# EAGLE design FreeVario F101 V1.1 (EAGLE 8.2.2)
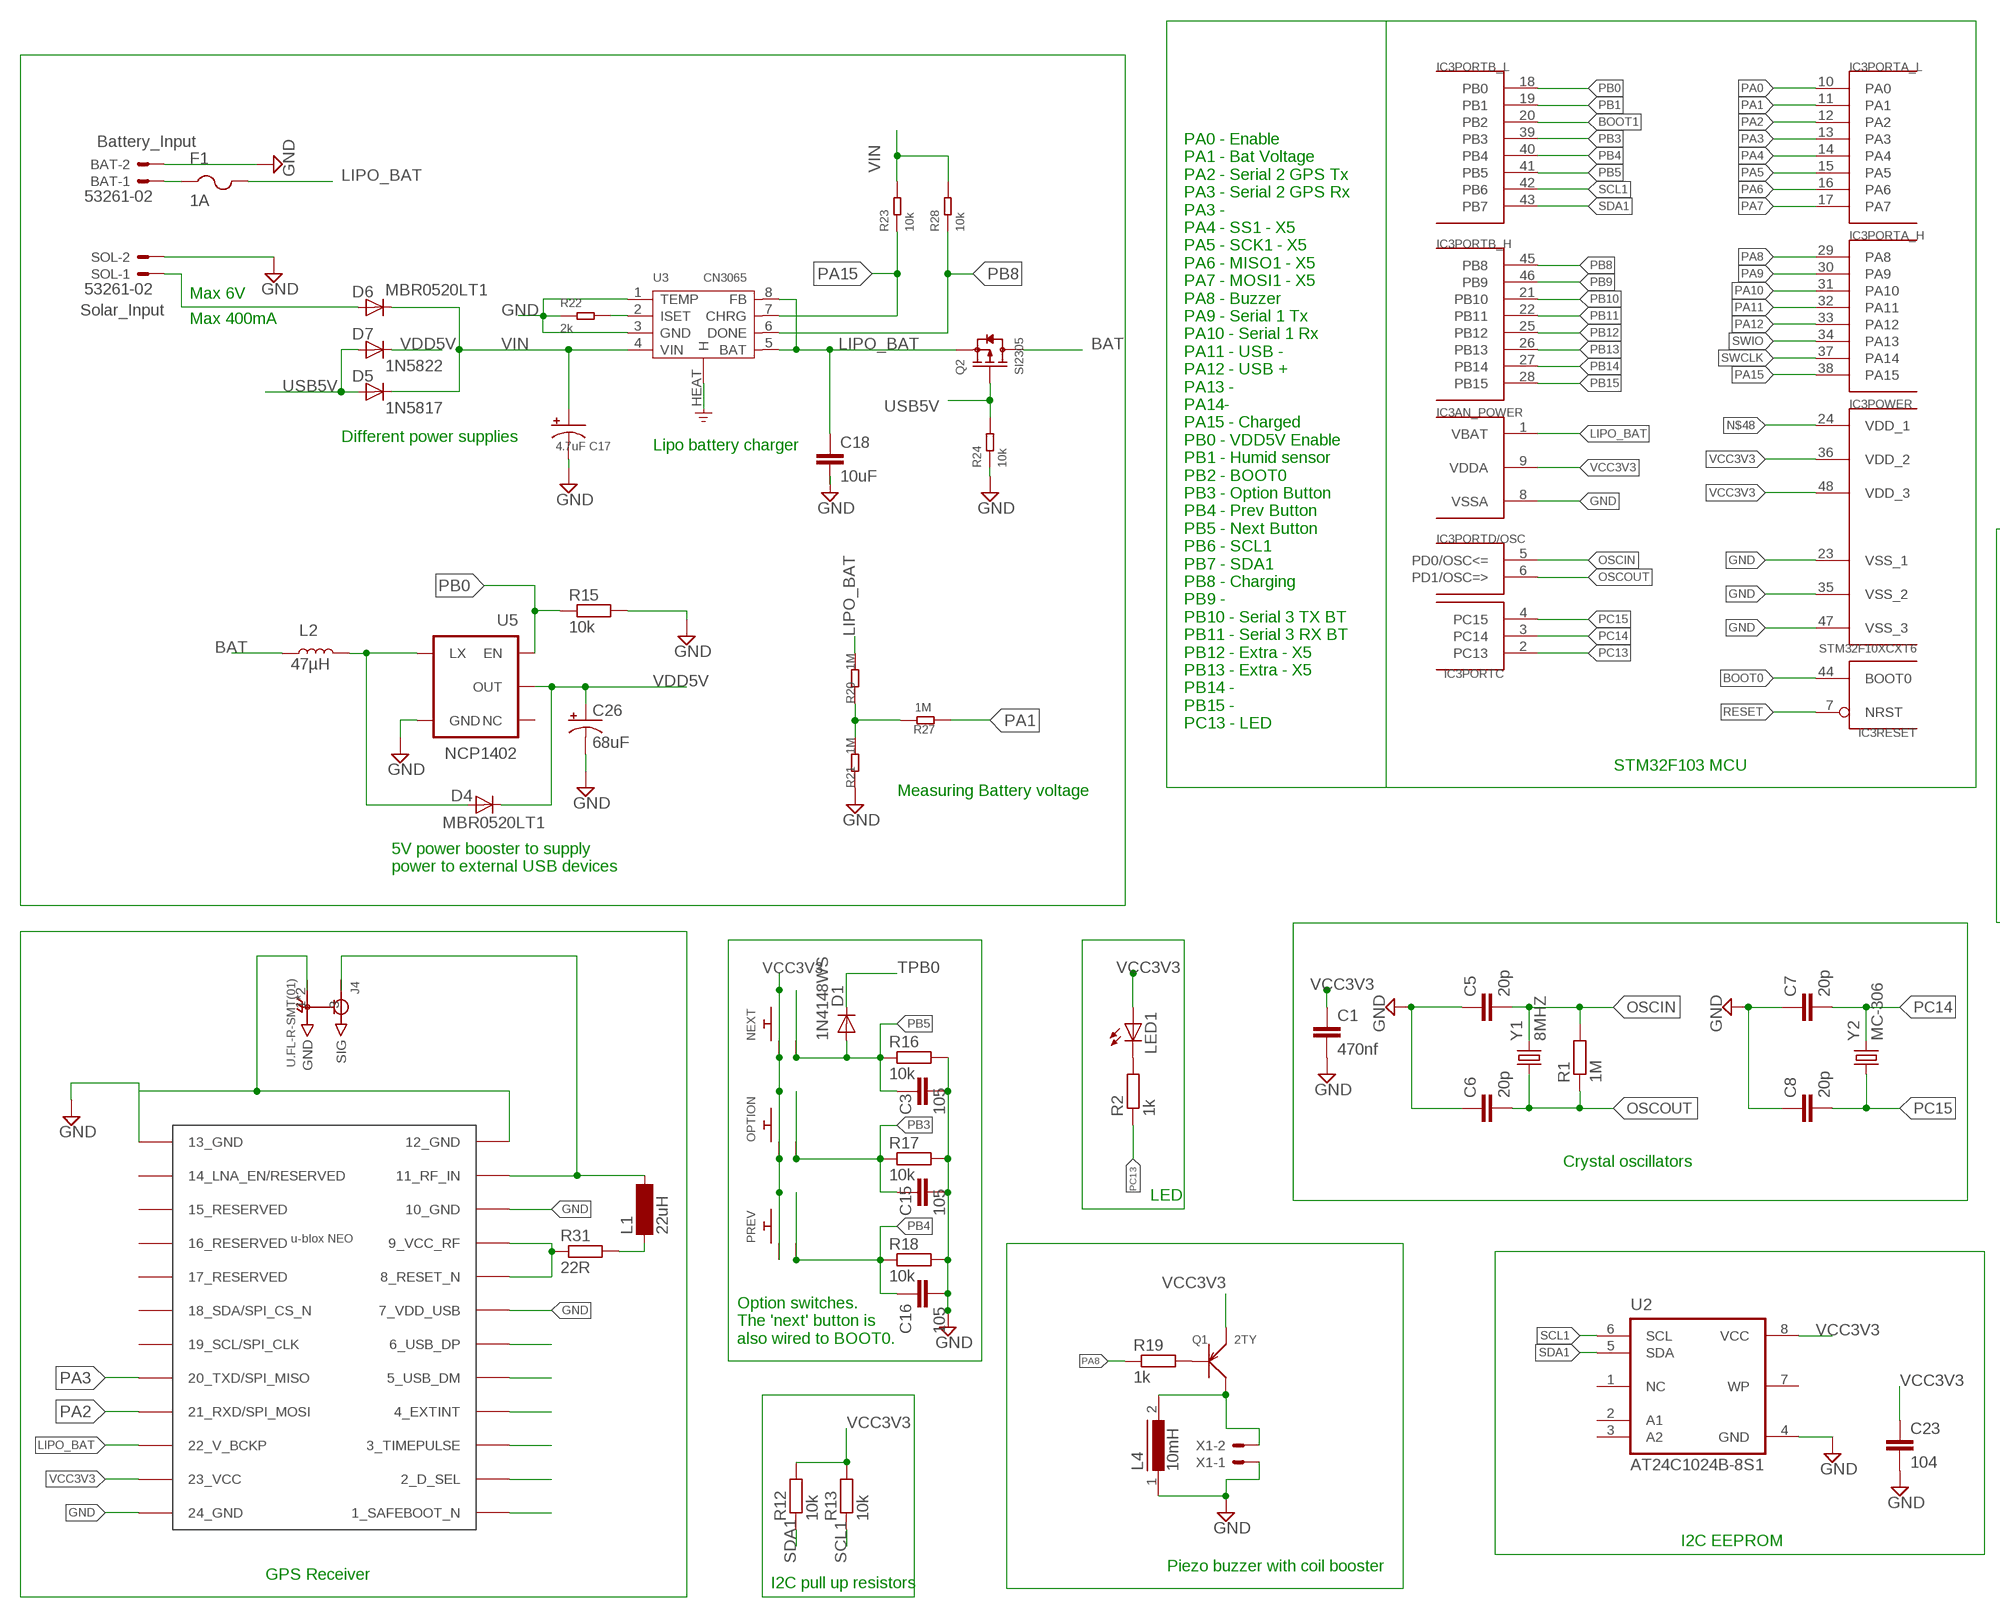
[diagram p0: schematic, sheet 1, part 1 of 2]
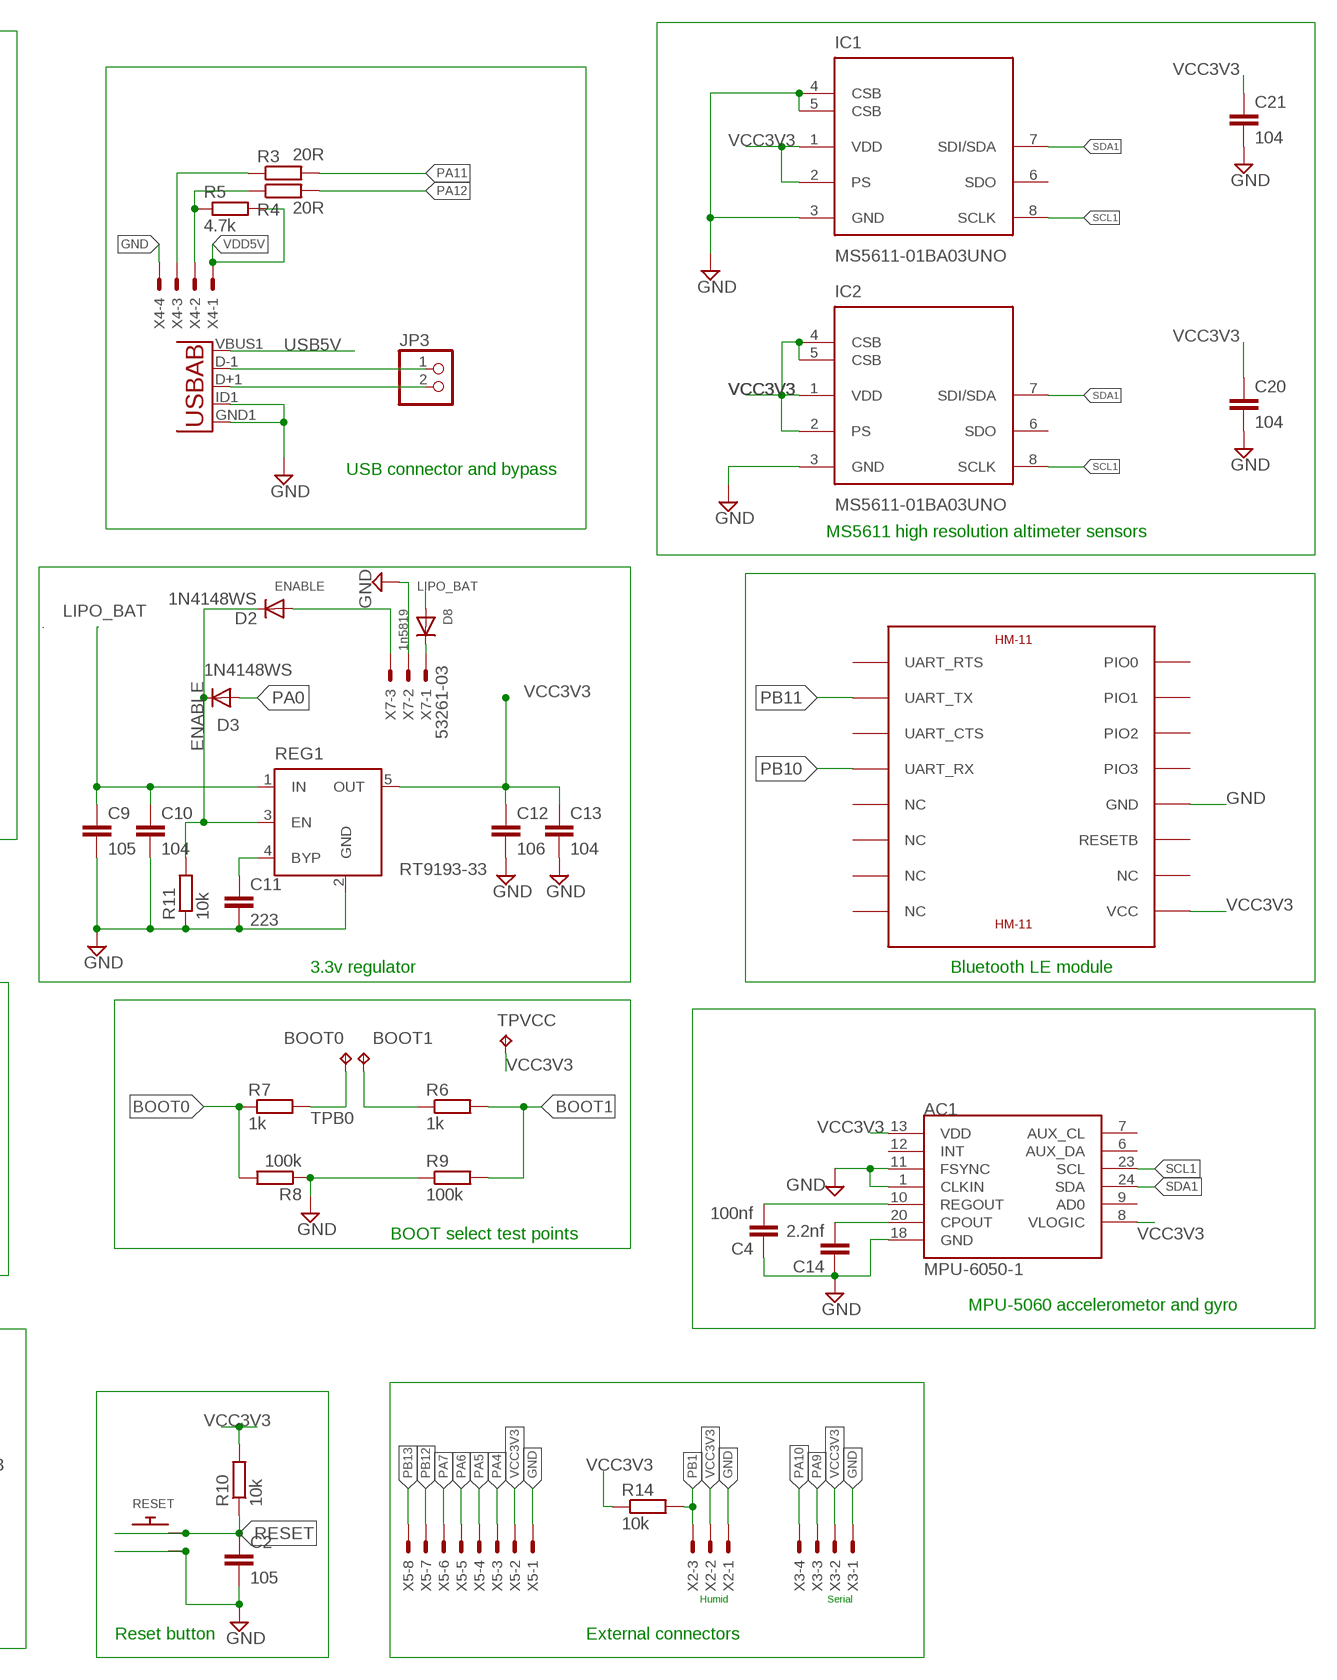
[diagram p1: schematic, sheet 1, part 2 of 2]

## Parts
AC1  MPU-6050-1  [QFN-24-4MM2]
BAT  53261-02  [53261-02]
BOOT0  TPTP08R  [TP08R]
BOOT1  TPTP08R  [TP08R]
C1  470nf  C-EUC0603K  [C0603K]
C2  105  C-EUC0603  [C0603]
C3  105  C-EUC0603  [C0603]
C4  100nf  C-EUC0603K  [C0603K]
C5  20p  C-EUC0603K  [C0603K]
C6  20p  C-EUC0603K  [C0603K]
C7  20p  C-EUC0603K  [C0603K]
C8  20p  C-EUC0603K  [C0603K]
C9  105  C-EUC0603K  [C0603K]
C10  104  C-EUC0603K  [C0603K]
C11  223  C-EUC0603K  [C0603K]
C12  106  C-EUC0603K  [C0603K]
C13  104  C-EUC0603K  [C0603K]
C14  2.2nf  C-EUC0603K  [C0603K]
C15  105  C-EUC0603  [C0603]
C16  105  C-EUC0603  [C0603]
C17  4.7uF  10UF-POLAR-EIA3216-16V-10%(TANT)  [EIA3216]
C18  10uF  C-EUC0805  [C0805]
C20  104  C-EUC0603K  [C0603K]
C21  104  C-EUC0603K  [C0603K]
C23  104  C-EUC0603K  [C0603K]
C26  68uF  CAP_POL3528  [EIA3528]
D1  1N4148WS  DIODE-SOD323-R  [SOD323-R]
D2  1N4148WS  DIODE-SOD323-R  [SOD323-R]
D3  1N4148WS  DIODE-SOD323-R  [SOD323-R]
D4  MBR0520LT1  DIODESOD-123  [SOD-123]
D5  1N5817  DIODESOD-123  [SOD-123]
D6  MBR0520LT1  DIODESOD-123  [SOD-123]
D7  1N5822  DIODE-DO-214AC  [DO-214AC]
D8  1n5819  DIODESOD-123  [SOD-123]
F1  1A  PTCFUSE-1206  [R1206]
HM13  HM-11  [HM-11]
IC1  MS5611-01BA03UNO  [SON125P300X500X100-8N]
IC2  MS5611-01BA03UNO  [SON125P300X500X100-8N]
IC3  STM32F10XCXT6  [TQFP48]
J4  U.FL-R-SMT(01)  [HRS_U.FL-R-SMT(01)]
JP3  PINHD-1X2  [1X02]
L1  22uH  SM-1206  [SM-1206]
L2  47µH  INDUCTOR-CR54-47UH  [CR54]
L4  10mH  MMICC7  [MMICC7]
LED1  LEDCHIP-LED0603  [CHIP-LED0603]
NEXT  TS-015A  [TS-015A]
OPTION  TS-015A  [TS-015A]
PREV  TS-015A  [TS-015A]
Q1  2TY  SMD-TRANSISTORS-PNP-25V-500MA(SOT-23)  [SOT-23]
Q2  SI2305  MOSFET-P'SI2323CDS/SI2305DS<BR>'  [SOT-23]
R1  1M  R-EU_R0603  [R0603]
R2  1k  R-EU_R0603  [R0603]
R3  20R  R-EU_R0603  [R0603]
R4  20R  R-EU_R0603  [R0603]
R5  4.7k  R-EU_R0603  [R0603]
R6  1k  R-EU_R0603  [R0603]
R7  1k  R-EU_R0603  [R0603]
R8  100k  R-EU_R0603  [R0603]
R9  100k  R-EU_R0603  [R0603]
R10  10k  R-EU_R0603  [R0603]
R11  10k  R-EU_R0603  [R0603]
R12  10k  R-EU_R0603  [R0603]
R13  10k  R-EU_R0603  [R0603]
R14  10k  R-EU_R0603  [R0603]
R15  10k  R-EU_R0603  [R0603]
R16  10k  R-EU_R0603  [R0603]
R17  10k  R-EU_R0603  [R0603]
R18  10k  R-EU_R0603  [R0603]
R19  1k  R-EU_R0603  [R0603]
R20  1M  R-0603  [0603]
R21  1M  R-0603  [0603]
R22  2k  RES-0603  [R0603]
R23  10k  RES-0603  [R0603]
R24  10k  RES-0603  [R0603]
R27  1M  R-0603  [0603]
R28  10k  RES-0603  [R0603]
R31  22R  R-EU_R0603  [R0603]
REG1  RT9193-33  MIC5219XX  [SOT23-5]
RESET  TS-015A  [TS-015A]
SOL  53261-02  [53261-02]
TPVCC  TPTP08SQ  [TP08SQ]
U1  USB""  [USB-MICRO-SMD]
U2  AT24C1024B-8S1  [SO08-8S1]
U3  CN3065  PMIC-CN3065-DFN8  [DFN-8]
U4  NEO-M8  [NEO-M8]
U5  NCP1402  V_REG_NCP1400SOT23-5  [SOT23-5]
X1  53261-02  [53261-02]
X2  53261-03  [53261-03]
X3  53261-04  [53261-04]
X4  53261-04  [53261-04]
X5  53261-08  [53261-08]
X7  53261-03  [53261-03]
Y1  8MHZ  CRYSTALSM49  [SM49]
Y2  MC-306  [MC-306]

## Nets
BAT: L2.P$1 Q2.3(D)
BOOT0: IC3.44(RESET:BOOT0) R7.1 R8.2
BOOT1: IC3.20(PORTB_L:PB2) R6.2 R9.2
ENABLE: D2.C D3.C R11.2 REG1.3(EN)
GND: AC1.1(CLKIN) AC1.11(FSYNC) AC1.18(GND) BAT.2 C1.2 C2.2 C3.2 C4.1 C5.1 C6.1 C7.1 C8.1 C9.2 C10.2 C11.2 C12.2 C13.2 C14.1 C15.2 C16.2 C17.- C18.2 C20.2 C23.2 C26.C(-) HM13.GND IC1.3(GND) IC1.4(CSB) IC1.5(CSB) IC2.3(GND) IC3.8(AN_POWER:VSSA) IC3.23(POWER:VSS_1) IC3.35(POWER:VSS_2) IC3.47(POWER:VSS_3) J4.1(GND) J4.2(GND) L4.1 R8.1 R9.1 R11.1 R15.2 R16.2 R17.2 R18.2 R21.1 R22.1 R24.1 REG1.2(GND) RESET.P$2 RESET.P$4 SOL.2 U1.GND1(GND) U1.ID1(USBID) U2.4(GND) U3.1(TEMP) U3.3(GND) U3.HEAT(H) U4.7(7_VDD_USB) U4.10(10_GND) U4.12(12_GND) U4.13(13_GND) U4.24(24_GND) U5.4(GND) X1.1 X2.1 X3.1 X4.4 X5.1 X7.2 ; supply symbol labelled GND_POWER
LIPO_BAT: C9.1 C10.1 C18.1 D8.A F1.2 IC3.1(AN_POWER:VBAT) Q2.2(S) R20.2 REG1.1(IN) U3.5(BAT) U3.8(FB) U4.22(22_V_BCKP)
N$1: D8.C X7.1
N$4: LED1.C R2.2
N$5: C11.1 REG1.4(BYP)
N$8: R3.1 X4.3
N$9: R4.1 R5.1 X4.2
N$11: BAT.1 F1.1
N$12: BOOT1.TP R6.1
N$17: R20.1 R21.2 R27.2
N$25: D2.A X7.3
N$28: Q1.1(B) R19.2
N$29: D6.A SOL.1
N$30: AC1.10(REGOUT) C4.2
N$32: R22.2 U3.2(ISET)
N$33: AC1.20(CPOUT) C14.2
N$34: L4.2 Q1.3(C) X1.2
N$36: JP3.1 U1.D-1(D-)
N$38: JP3.2 U1.D+1(D+)
N$40: D4.A L2.P$2 U5.5(LX)
N$42: J4.3(SIG) L1.2 U4.11(11_RF_IN)
N$43: L1.1 R31.2
N$45: R31.1 U4.8(8_RESET_N) U4.9(9_VCC_RF)
N$48: IC3.24(POWER:VDD_1)
N$52: U4.6(6_USB_DP)
N$54: U4.5(5_USB_DM)
N$55: U4.4(4_EXTINT)
N$56: U4.3(3_TIMEPULSE)
N$57: U4.2(2_D_SEL)
N$58: U4.1(1_SAFEBOOT_N)
OSCIN: C5.2 IC3.5(PORTD/OSC:PD0/OSC<=) R1.2 Y1.2
OSCOUT: C6.2 IC3.6(PORTD/OSC:PD1/OSC=>) R1.1 Y1.1
PA0: D3.A IC3.10(PORTA_L:PA0)
PA1: IC3.11(PORTA_L:PA1) R27.1
PA2: IC3.12(PORTA_L:PA2) U4.21(21_RXD/SPI_MOSI)
PA3: IC3.13(PORTA_L:PA3) U4.20(20_TXD/SPI_MISO)
PA4: IC3.14(PORTA_L:PA4) X5.3
PA5: IC3.15(PORTA_L:PA5) X5.4
PA6: IC3.16(PORTA_L:PA6) X5.5
PA7: IC3.17(PORTA_L:PA7) X5.6
PA8: IC3.29(PORTA_H:PA8) R19.1
PA9: IC3.30(PORTA_H:PA9) X3.3
PA10: IC3.31(PORTA_H:PA10) X3.4
PA11: IC3.32(PORTA_H:PA11) R3.2
PA12: IC3.33(PORTA_H:PA12) R4.2
PA15: IC3.38(PORTA_H:PA15) R23.1 U3.7(CHRG)
PB0: IC3.18(PORTB_L:PB0) R15.1 U5.1(EN)
PB1: IC3.19(PORTB_L:PB1) R14.2 X2.3
PB3: C15.1 IC3.39(PORTB_L:PB3) OPTION.P$2 OPTION.P$4 R17.1
PB4: C16.1 IC3.40(PORTB_L:PB4) PREV.P$2 PREV.P$4 R18.1
PB5: C3.1 D1.A IC3.41(PORTB_L:PB5) NEXT.P$2 NEXT.P$4 R16.1
PB8: IC3.45(PORTB_H:PB8) R28.1 U3.6(DONE)
PB9: IC3.46(PORTB_H:PB9)
PB10: HM13.UART_RX IC3.21(PORTB_H:PB10)
PB11: HM13.UART_TX IC3.22(PORTB_H:PB11)
PB12: IC3.25(PORTB_H:PB12) X5.7
PB13: IC3.26(PORTB_H:PB13) X5.8
PB14: IC3.27(PORTB_H:PB14)
PB15: IC3.28(PORTB_H:PB15)
PC13: IC3.2(PORTC:PC13) R2.1
PC14: C7.2 IC3.3(PORTC:PC14) Y2.4
PC15: C8.2 IC3.4(PORTC:PC15) Y2.1
RESET: C2.1 IC3.7(RESET:NRST) R10.1 RESET.P$1 RESET.P$3
SCL1: AC1.23(SCL) IC1.8(SCLK) IC2.8(SCLK) IC3.42(PORTB_L:PB6) R13.1 U2.6(SCL)
SDA1: AC1.24(SDA) IC1.7(SDI/SDA) IC2.7(SDI/SDA) IC3.43(PORTB_L:PB7) R12.1 U2.5(SDA)
SWCLK: IC3.37(PORTA_H:PA14)
SWIO: IC3.34(PORTA_H:PA13)
TPB0: BOOT0.TP D1.C R7.2
USB5V: D5.A D7.A Q2.1(G) R24.2 U1.VBUS1(VBUS)
VCC3V3: AC1.8(VLOGIC) AC1.13(VDD) C1.1 C12.1 C13.1 C20.1 C21.1 C23.1 HM13.VCC IC1.1(VDD) IC1.2(PS) IC2.1(VDD) IC2.2(PS) IC2.4(CSB) IC2.5(CSB) IC3.9(AN_POWER:VDDA) IC3.36(POWER:VDD_2) IC3.48(POWER:VDD_3) LED1.A NEXT.P$1 NEXT.P$3 OPTION.P$1 OPTION.P$3 PREV.P$1 PREV.P$3 Q1.2(E) R10.2 R12.2 R13.2 R14.1 REG1.5(OUT) TPVCC.TP U2.8(VCC) U4.23(23_VCC) X2.2 X3.2 X5.2
VDD5V: C26.A(+) D4.C D7.C R5.2 U5.2(OUT) X4.1
VIN: C17.+ D5.C D6.C R23.2 R28.2 U3.4(VIN)
Unconnected: AC1.6(AUX_DA) AC1.7(AUX_CL) AC1.9(AD0) AC1.12(INT) C21.2 HM13.NC@5(NC) HM13.NC@6(NC) HM13.NC@7(NC) HM13.NC@8(NC) HM13.NC@10(NC) HM13.PIO0 HM13.PIO1 HM13.PIO2 HM13.PIO3 HM13.RESETB HM13.UART_CTS HM13.UART_RTS IC1.6(SDO) IC2.6(SDO) U2.1(NC) U2.2(A1) U2.3(A2) U2.7(WP) U4.14(14_LNA_EN/RESERVED) U4.15(15_RESERVED) U4.16(16_RESERVED) U4.17(17_RESERVED) U4.18(18_SDA/SPI_CS_N) U4.19(19_SCL/SPI_CLK) U5.3(NC)

## Notes on the sheet
- Battery_Input
- Max 6V
- Solar_Input
- Max 400mA
- Different power supplies | USB connector and bypass
- Lipo battery charger
- MS5611 high resolution altimeter sensors
- PA0 - Enable
  PA1 - Bat Voltage
  PA2 - Serial 2 GPS Tx
  PA3 - Serial 2 GPS Rx
  PA3 - 
  PA4 - SS1 - X5
  PA5 - SCK1 - X5
  PA6 - MISO1 - X5
  PA7 - MOSI1 - X5
  PA8 - Buzzer
  PA9 - Serial 1 Tx
  PA10 - Serial 1 Rx
  PA11 - USB -
  PA12 - USB +
  PA13 - 
  PA14- 
  PA15 - Charged
  PB0 - VDD5V Enable
  PB1 - Humid sensor
  PB2 - BOOT0
  PB3 - Option Button
  PB4 - Prev Button
  PB5 - Next Button
  PB6 - SCL1
  PB7 - SDA1
  PB8 - Charging
  PB9 -  
  PB10 - Serial 3 TX BT
  PB11 - Serial 3 RX BT
  PB12 - Extra - X5
  PB13 - Extra - X5
  PB14 - 
  PB15 - 
  PC13 - LED
- STM32F103 MCU
- Measuring Battery voltage
- 5V power booster to supply 
  power to external USB devices
- 3.3v regulator | Bluetooth LE module
- Crystal oscillators | BOOT select test points
- LED
- MPU-5060 accelerometor and gyro
- Option switches. 
  The 'next' button is 
  also wired to BOOT0.
- Humid | Serial
- I2C EEPROM | Reset button | External connectors
- Piezo buzzer with coil booster
- GPS Receiver
- I2C pull up resistors

## Library data of the parts
AC1 = mpu5060:MPU-6050
BAT SOL = con-molex:53?-02: CONNECTOR wire to board 1.25 mm (.049 inch) pitch header; OC_FARNELL: 1125373; OC_NEWARK: unknown
BOOT0 BOOT1 TPVCC = testpad:TP: Test pad
C1-C16 C18 C20 C21 C23 = rcl:C-EU: CAPACITOR, European symbol
C17 = SparkFun-Capacitors:10UF-POLAR: 10.0µF polarized capacitors A capacitor is a passive two-terminal electrical component used to store electrical energy temporarily in an electric field.; PROD_ID: CAP-00811; VALUE: 10uF
C26 = SparkFun:CAP_POL: Capacitor Polarized These are standard SMD and PTH capacitors. Normally 10uF, 47uF, and 100uF in electrolytic and tantalum varieties. Always verify the external diameter of the through hole cap, it varies with capacity, voltage, and manufacturer. The EIA devices should be standard.
D1-D3 D7 = diode:DIODE-: DIODE
D4-D6 D8 = adafruit:DIODE: Diode SMADIODE - SMA Surface Mount Package 20V 1A Schottky Diode Digikey: 641-1014-6-ND DO-1N4148 - Through Hole Small Current Diode SOD-123 20V 1 A (.5mV Vf) Schottky Diode - Digikey: MBRX120TPMSCT-ND SOD-323 10V 570mA (.38mV Vf, 3ns) Schottky Diode - Digikey: ZLLS410CT-ND SOD-523 30V 30mA Schottky Diode (RB751S-40TE61) - Digikey: RB751S-40TE61CT-ND SOT23-R/W - SOT23 Package (R = Solder Paste/Reflow Ovens, W = Hand-Soldering) BAT54Film 40V 300mA - Digikey: 497-7162-1-ND
F1 = adafruit:PTCFUSE: PTC fuses, resettable thermistors
HM13 = hm-11:HM-11: JNHuaMao HM-11 Bluetooth 4.0 Transceiver based on TI CC2540/CC2541
IC1 IC2 = Measurement-Specialties:MS5611-01BA03: Variometer Module, with stainless steel cap
IC3 = stm32:STM32F10XCXT6: ST STM32F101/103 48pin LQFP
J4 = U.FL-R-SMT_01_:U.FL-R-SMT(01): U.FL Series 6 Ghz 50 Ohm Ultra-small SMT Coaxial Cable Receptacle; AVAILABILITY: Good; DESCRIPTION: U.FL Series 6 Ghz 50 Ohm Ultra-small SMT Coaxial Cable Receptacle; MF: Hirose; MP: U.FL-R-SMT(01); PACKAGE: None; PRICE: 0.85 USD
JP3 = pinhead:PINHD-1X2: PIN HEADER
L1 = inductor-neosid:SM-1206: INDUCTOR SMD chip inductor; OC_FARNELL: unknown; OC_NEWARK: unknown
L2 = SparkFun-Coils:INDUCTOR: Inductors Resist changes in electrical current. Basically a coil of wire. SparkFun Products: SparkFun Load Cell Amplifier - HX711 <https://www.sparkfun.com/products/13879> IOIO-OTG - V2.2 <https://www.sparkfun.com/products/13613>; PROD_ID: NDUC-10789; VALUE: 47µH/±30%/750mA
L4 = inductors:MMICC7: INDUCTOR
LED1 = adafruit:LED: LED OSRAM: - CHIPLED LG R971, LG N971, LY N971, LG Q971, LY Q971, LO R971, LY R971 LH N974, LH R974 LS Q976, LO Q976, LY Q976 LO Q996 - Hyper CHIPLED LW Q18S LB Q993, LB Q99A, LB R99A - SideLED LS A670, LO A670, LY A670, LG A670, LP A670 LB A673, LV A673, LT A673, LW A673 LH A674 LY A675 LS A676, LA A676, LO A676, LY A676, LW A676 LS A679, LY A679, LG A679 - Hyper Micro SIDELED® LS Y876, LA Y876, LO Y876, LY Y876 LT Y87S - SmartLED LW L88C, LW L88S LB L89C, LB L89S, LG L890 LS L89K, LO L89K, LY L89K LS L896, LA L896, LO L896, LY L896 - TOPLED LS T670, LO T670, LY T670, LG T670, LP T670 LSG T670, LSP T670, LSY T670, LOP T670, LYG T670 LG T671, LOG T671, LSG T671 LB T673, LV T673, LT T673, LW T673 LH T674 LS T676, LA T676, LO T676, LY T676, LB T676, LH T676, LSB T676, LW T676 LB T67C, LV T67C, LT T67C, LS T67K, LO T67K, LY T67K, LW E67C LS E67B, LA E67B, LO E67B, LY E67B, LB E67C, LV E67C, LT E67C LW T67C LS T679, LY T679, LG T679 LS T770, LO T770, LY T770, LG T770, LP T770 LB T773, LV T773, LT T773, LW T773 LH T774 LS E675, LA E675, LY E675, LS T675 LS T776, LA T776, LO T776, LY T776, LB T776 LHGB T686 LT T68C, LB T68C - Hyper Mini TOPLED® LB M676 - Mini TOPLED Santana® LG M470 LS M47K, LO M47K, LY M47K Source: http://www.osram.convergy.de/
NEXT OPTION PREV RESET = ts-015a switch:TS-015A: TS-15A
Q1 = SMD-TRANSISTORS-PNP-25V-500MA_SOT-23_:SMD-TRANSISTORS-PNP-25V-500MA(SOT-23): 305020006; AVAILABILITY: Unavailable; DESCRIPTION: SMD Transistors PNP 25V 500mA; MF: Seeed Studio; MP: S8550; PACKAGE: None; PRICE: None
Q2 = Discrete-new:MOSFET-P
R1-R18 R31 = rcl:R-EU_: RESISTOR, European symbol
R19 = resistor:R-EU_: RESISTOR, European symbol
R20 R21 R27 = Discrete:R*
R22-R24 R28 = Discrete-new:RES
REG1 = v-reg-micrel:MIC5219XX: VOLTAGE REGULATOR; OC_FARNELL: unknown; OC_NEWARK: unknown
U1 = MicroUSB:USB: This is a USB AB connector that is compatible with USB OTG. i.e. this connector can serve as a host or device
U2 = memory-atmel:AT24C1024B: EEPROM SPI bus serial, 1M (131,072 x 8)
U3 = IC-new:PMIC-CN3065: 310030101
U4 = ubloxLib:NEO-M8: u-blox NEO GNSS module
U5 = SparkFun:V_REG_NCP1400: Switching step-up voltage regulator NCP1400 switiching regulator takes single cell AA and outputs 100mA at 3.3V or 5V with minimal number of external components.
X1 = con-molex:53?-02: CONNECTOR wire to board 1.25 mm (.049 inch) pitch header
X2 = con-molex:53?-03: CONNECTOR wire to board 1.25 mm (.049 inch) pitch header
X3 X4 = con-molex:53?-04: CONNECTOR wire to board 1.25 mm (.049 inch) pitch header
X5 = con-molex:53?-08: CONNECTOR wire to board 1.25 mm (.049 inch) pitch header
X7 = con-molex:53?-03: CONNECTOR wire to board 1.25 mm (.049 inch) pitch header; MF: MOLEX; MPN: 53261-0390; OC_FARNELL: 1125359; OC_NEWARK: 57H5006
Y1 = adafruit:CRYSTAL: CRYSTAL; OC_FARNELL: unknown; OC_NEWARK: unknown
Y2 = crystal:MC-306: kHz RANGE CRYSTAL UNIT SMD Source: MC-306_405_406_E07X.PDF Homepage <http://www.epsontoyocom.co.jp>; MPN: MC-306 60.0KHZ 100PPM ,12.5PF; OC_FARNELL: 1278040; OC_NEWARK: 31M5576

## Board
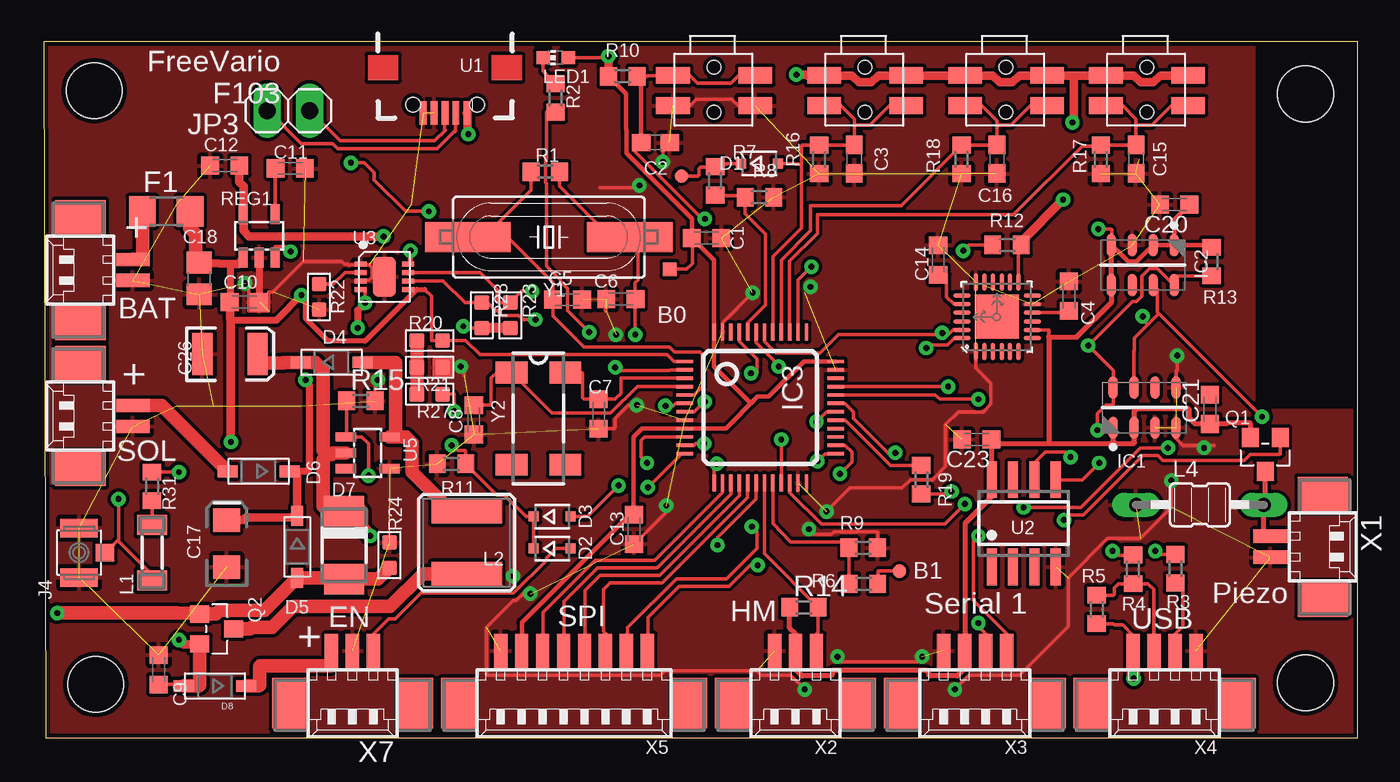
[diagram p2: board, top side]
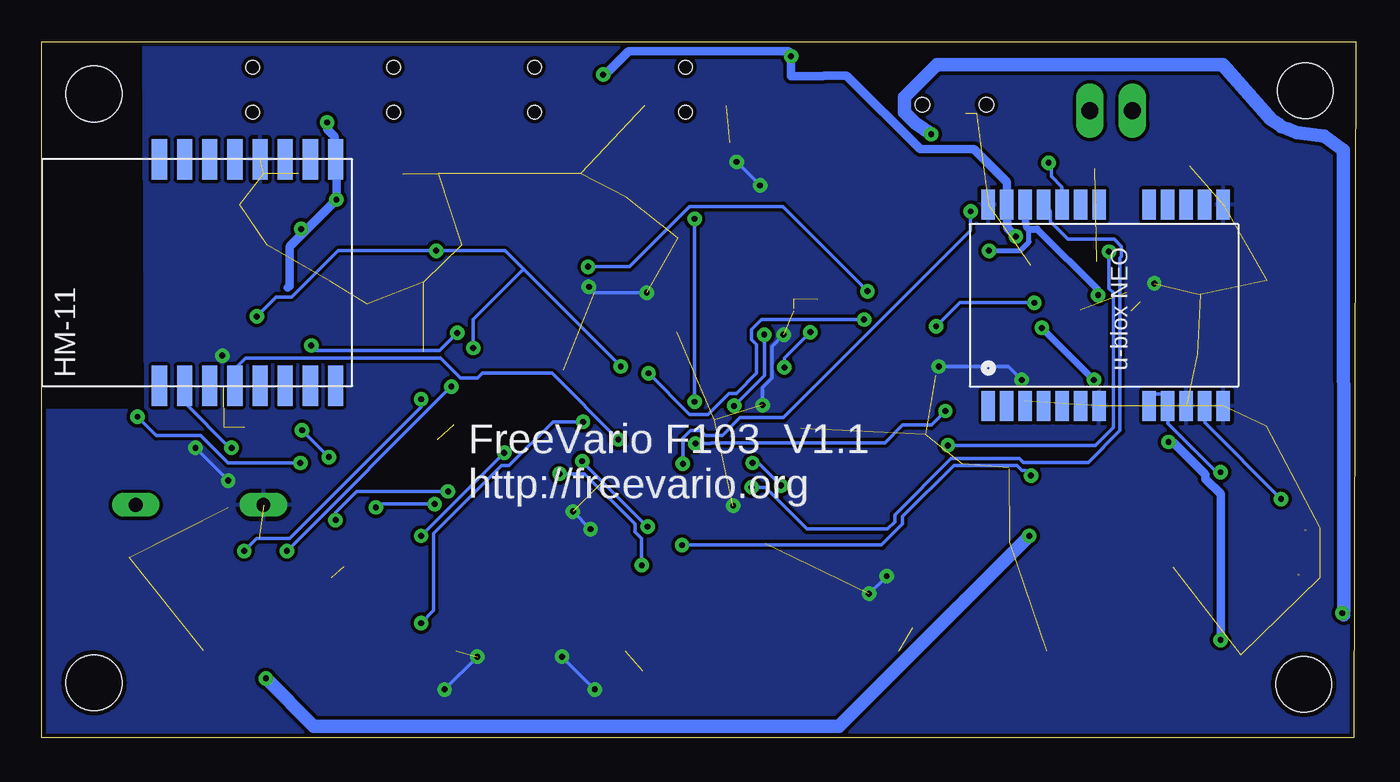
[diagram p3: board, bottom side, seen from below]

Size 78.3 x 41.5 mm. Coordinates in mm from the lower left corner, seen from the top.
Outline: 78.3,0 78.3,41.5 0,41.5 0.1,0 78.3,0
Copper layers (1*16): Top 0.035mm / dielectric 1.5mm / Bottom 0.035mm
Design rules "SparkFun": minimum track width 8mil, minimum drill 20mil, track to track 8mil, track to pad 8mil, pad to pad 8mil, via to via 8mil, smd to smd 8mil, copper to edge 10mil, drill to drill 8mil, minimum pad ring 12mil, minimum via ring 10mil, stop-mask expansion 4mil, vias tented up to drill 25mil, thermal gap 10mil
tRestrict: area 72.3,19.7 to 78.3,41.5
bRestrict: area 72.3,19.7 to 78.3,41.5

### Footprints (pad centres in the part's own frame; a part is rotated, then mirrored left to right if it is on the bottom)
QFN-24-4MM2 = smd 1.016 x 0.254: 1 -2.066,1.257; 2 -2.066,0.75; 3 -2.066,0.247; 4 -2.066,-0.287; 5 -2.066,-0.792; 6 -2.066,-1.297; 13 2.086,-1.297; 14 2.086,-0.792; 15 2.086,-0.287; 16 2.086,0.247; 17 2.086,0.75; 18 2.086,1.257 | smd 0.254 x 1.016: 7 -1.267,-2.122; 8 -0.762,-2.122; 9 -0.258,-2.122; 10 0.278,-2.122; 11 0.78,-2.122; 12 1.287,-2.122; 19 1.287,2.082; 20 0.78,2.082; 21 0.278,2.082; 22 -0.258,2.082; 23 -0.762,2.082; 24 -1.267,2.082 | smd 2.616 x 2.616: P$1 0.02,-0.01
53261-02 = smd 0.8 x 2: 1 0.625,-2.5; 2 -0.625,-2.5 | smd 2.1 x 3: S1 3.125,0.625; S2 -3.125,0.625
TP08R = smd 0.8 x 0.8: TP 0,0
C0603K = smd 1.05 x 1.08: 1 -0.875,0; 2 0.875,0
C0603 = smd 1.1 x 1: 1 -0.85,0; 2 0.85,0
EIA3216 = smd 1.4 x 1.6: + 1.4,0; - -1.4,0
C0805 = smd 1.3 x 1.5: 1 -0.95,0; 2 0.95,0
EIA3528 = smd 1.2 x 2.5: A 1.65,0; C -1.65,0
SOD323-R = smd 0.6 x 0.6: A 1.1,0; C -1.1,0
SOD-123 = smd 1.2 x 0.7: A 1.85,0; C -1.85,0
DO-214AC = smd 1.8 x 2.4: A 2.025,0; C -2.025,0
R1206 = smd 1.6 x 1.803: 1 -1.422,0; 2 1.422,0
HM-11 = smd 2.4 x 0.9: GND 6.5,0; NC@5 -7,0; NC@6 -7,-1.5; NC@7 -7,-3; NC@8 -7,-4.5; NC@10 6.5,-3; PIO0 6.5,6; PIO1 6.5,4.5; PIO2 6.5,3; PIO3 6.5,1.5; RESETB 6.5,-1.5; UART_CTS -7,3; UART_RTS -7,6; UART_RX -7,1.5; UART_TX -7,4.5; VCC 6.5,-4.5
SON125P300X500X100-8N = smd 1.35 x 0.55: 1 -1.2,1.875; 2 -1.2,0.625; 3 -1.2,-0.625; 4 -1.2,-1.875; 5 1.2,-1.875; 6 1.2,-0.625; 7 1.2,0.625; 8 1.2,1.875
TQFP48 = smd 0.2 x 1: 1 -2.75,-4.5; 2 -2.25,-4.5; 3 -1.75,-4.5; 4 -1.25,-4.5; 5 -0.75,-4.5; 6 -0.25,-4.5; 7 0.25,-4.5; 8 0.75,-4.5; 9 1.25,-4.5; 10 1.75,-4.5; 11 2.25,-4.5; 12 2.75,-4.5; 25 2.75,4.5; 26 2.25,4.5; 27 1.75,4.5; 28 1.25,4.5; 29 0.75,4.5; 30 0.25,4.5; 31 -0.25,4.5; 32 -0.75,4.5; 33 -1.25,4.5; 34 -1.75,4.5; 35 -2.25,4.5; 36 -2.75,4.5 | smd 1 x 0.2: 13 4.5,-2.75; 14 4.5,-2.25; 15 4.5,-1.75; 16 4.5,-1.25; 17 4.5,-0.75; 18 4.5,-0.25; 19 4.5,0.25; 20 4.5,0.75; 21 4.5,1.25; 22 4.5,1.75; 23 4.5,2.25; 24 4.5,2.75; 37 -4.5,2.75; 38 -4.5,2.25; 39 -4.5,1.75; 40 -4.5,1.25; 41 -4.5,0.75; 42 -4.5,0.25; 43 -4.5,-0.25; 44 -4.5,-0.75; 45 -4.5,-1.25; 46 -4.5,-1.75; 47 -4.5,-2.25; 48 -4.5,-2.75
HRS_U.FL-R-SMT(01) = smd 1.1 x 2.25: 1 -1.475,0; 2 1.475,0 | smd 1.05 x 1.1: 3 0,-1.55
1X02 = drill 1.016 long: 1 -1.27,0; 2 1.27,0
SM-1206 = smd 1.2 x 1.8: 1 -1.65,0; 2 1.65,0
CR54 = smd 4.2 x 1.4: P$1 0,1.85; P$2 0,-1.85
MMICC7 = drill 0.813 long: 1 -3.81,0; 2 3.81,0
CHIP-LED0603 = smd 0.8 x 0.8: A 0,-0.75; C 0,0.75
TS-015A = smd 2 x 1: P$1 1,0.5; P$2 1,2.3; P$3 5.9,0.5; P$4 5.9,2.3 | hole 0.8: 3.45,2.68; 3.45,0
SOT-23 = smd 1.016 x 1.143: 1 -0.889,-1.016; 2 0.889,-1.016; 3 0,1.016
R0603 = smd 1 x 1.1: 1 -0.85,0; 2 0.85,0
0603 = smd 0.889 x 0.889: 1 -0.762,0; 2 0.762,0
R0603' = smd 0.889 x 0.889: 1 -0.762,0; 2 0.762,0
SOT23-5 = smd 0.55 x 1.2: 1 -0.95,-1.3; 2 0,-1.3; 3 0.95,-1.3; 4 0.95,1.3; 5 -0.95,1.3
TP08SQ = smd 0.8 x 0.8: TP 0,0
USB-MICRO-SMD = smd 1.4 x 0.4: D+1 2.7,0; D-1 2.7,0.65; GND1 2.7,-1.3; ID1 2.7,-0.65; VBUS1 2.7,1.3 | hole 0.85: 2.2,1.9; 2.2,-1.9
SO08-8S1 = smd 0.6 x 2.2: 1 -1.905,-2.6; 2 -0.635,-2.6; 3 0.635,-2.6; 4 1.905,-2.6; 5 1.905,2.6; 6 0.635,2.6; 7 -0.635,2.6; 8 -1.905,2.6
DFN-8 = smd 0.3 x 0.727: 1 -0.75,-1.413; 2 -0.25,-1.413; 3 0.25,-1.413; 4 0.75,-1.413; 5 0.75,1.413; 6 0.25,1.413; 7 -0.25,1.413; 8 -0.75,1.413 | smd 2.413 x 1.397: HEAT 0,0
NEO-M8 = smd 1.8 x 0.8: 1 6.4,-7.4; 2 6.4,-6.3; 3 6.4,-5.2; 4 6.4,-4.1; 5 6.4,-3; 6 6.4,-1.9; 7 6.4,-0.8; 8 6.4,2.2; 9 6.4,3.3; 10 6.4,4.4; 11 6.4,5.5; 12 6.4,6.6; 13 -5.6,6.6; 14 -5.6,5.5; 15 -5.6,4.4; 16 -5.6,3.3; 17 -5.6,2.2; 18 -5.6,-0.8; 19 -5.6,-1.9; 20 -5.6,-3; 21 -5.6,-4.1; 22 -5.6,-5.2; 23 -5.6,-6.3; 24 -5.6,-7.4
STAND-OFF = hole 3.302: 0,0
53261-03 = smd 0.8 x 2: 1 1.25,-2.5; 2 0,-2.5; 3 -1.25,-2.5 | smd 2.1 x 3: S1 3.75,0.625; S2 -3.75,0.625
53261-04 = smd 0.8 x 2: 1 1.875,-2.5; 2 0.625,-2.5; 3 -0.625,-2.5; 4 -1.875,-2.5 | smd 2.1 x 3: S1 4.375,0.625; S2 -4.375,0.625
53261-08 = smd 0.8 x 2: 1 4.375,-2.5; 2 3.125,-2.5; 3 1.875,-2.5; 4 0.625,-2.5; 5 -0.625,-2.5; 6 -1.875,-2.5; 7 -3.125,-2.5; 8 -4.375,-2.5 | smd 2.1 x 3: S1 6.875,0.625; S2 -6.875,0.625
SM49 = smd 5.08 x 1.778: 1 -4.826,0; 2 4.826,0
MC-306 = smd 1.3 x 1.9: 1 -2.75,-1.6; 2 2.75,-1.6; 3 2.75,1.6; 4 -2.75,1.6

### Placement (x,y rotation side)
AC1  56.8,25.1 90 top
BAT  2.8,27.9 90 top
BOOT0  38,33.5 0 top
BOOT1  51,9.95 0 top
C1  39.5,29.81 0 top
C2  36.45,35.5 0 top
C3  48.3,34.5 270 top
C4  61.1,26.35 270 top
C5  31.2,26.13 180 top
C6  34.39,26.17 0 top
C7  33.07,19.32 90 top
C8  25.63,18.97 90 top
C9  6.84,4.07 90 top
C10  11.95,25.99 0 top
C11  14.69,33.96 0 top
C12  10.79,34.13 180 top
C13  35.17,12.44 270 top
C14  53.3,28.5 270 top
C15  65.1,34.5 270 top
C16  56.8,34.5 270 top
C17  10.9,11.6 90 top
C18  9.25,27.4 270 top
C20  67.4,31.8 180 top
C21  69.5,19.6 90 top
C23  55.6,17.8 180 top
C26  11.1,22.9 0 top
D1  42.65,34.25 0 top
D2  30.3,11.3 0 top
D3  30.3,13.2 0 top
D4  17.15,22.4 0 top
D5  15.1,11.4 270 top
D6  12.8,15.9 180 top
D7  17.9,11.5 270 top
D8  10.2,3.1 180 top
F1  7.3,31.4 0 top
HM13  65.3,28 90 bottom
IC1  65.6,19.7 90 top
IC2  65.5,28.2 270 top
IC3  42.7,19.7 270 top
J4  2.1,11.05 90 top
JP3  14.57,37.4 0 top
L1  6.45,11.05 270 top
L2  25.2,11.65 180 top
L4  68.9,13.9 0 top
LED1  30.51,40.56 90 top
NEXT  52.4,40 180 top
OPTION  69.2,40 180 top
PREV  60.8,40 180 top
Q1  72.8,16.9 180 top
Q2  10.3,6.5 270 top
R1  29.89,33.76 180 top
R2  30.5,38.16 90 top
R3  67.44,10.1 90 top
R4  64.91,10.06 90 top
R5  62.76,7.67 270 top
R6  48.85,9.19 180 top
R7  40.01,33.21 90 top
R8  42.65,32.24 180 top
R9  48.84,11.34 180 top
R10  34.5,39.45 180 top
R11  24.3,16.35 0 top
R12  57.4,29.4 0 top
R13  69.6,28.4 90 top
R14  45.3,7.8 0 top
R15  18.9,20.1 0 top
R16  46.2,34.5 270 top
R17  63,34.5 270 top
R18  54.7,34.5 270 top
R19  52.3,15.4 270 top
R20  23,23.7 0 top
R21  23,22.1 180 top
R22  2k  [R0603']  16.4,26.3 90 top
R23  10k  [R0603']  27.8,25.2 270 top
R24  10k  [R0603']  20.6,10.9 270 top
R27  23,20.5 180 top
R28  10k  [R0603']  26.1,25.2 270 top
R31  6.45,15 270 top
REG1  12.83,29.94 0 top
RESET  43.4,40 180 top
SOL  2.8,19.2 90 top
TPVCC  37.3,27.95 0 top
U1  23.91,39.96 270 top
U2  58.4,12.8 0 top
U3  20.3,27.5 270 top
U4  14.5,26.2 270 bottom
U5  19.3,17 270 top
U$1  [STAND-OFF]  3,38.6 0 top
U$2  [STAND-OFF]  3.1,3.2 0 top
U$3  [STAND-OFF]  75.2,38.4 0 top
U$4  [STAND-OFF]  75.2,3.3 0 top
X1  75.6,11.4 270 top
X2  44.8,2.7 180 top
X3  55.5,2.7 180 top
X4  66.8,2.7 180 top
X5  31.6,2.7 180 top
X7  18.4,2.7 180 top
Y1  30.1,29.86 180 top
Y2  29.48,19.04 270 top

### Tracks (layer width: path | path; a pad name or v marks a point on that pad's centre or on a via)
BAT
  Top 0.813: L2.P$1 22.6,9.8 20.65,7.85 14.85,7.85 13.6,6.6 12.4,6.6 12.3,6.5 Q2.3
BOOT0
  Top 0.203: R7.1 40.05,32.35 41.8,32.35 R8.2 41.8,31.25 43,30.05 43,25.8 41.95,24.75 IC3.44
BOOT1
  Top 0.2: IC3.20 43.45,12.8 44.5,11.7 48,11.7 R9.2 48,11.25 R6.2
ENABLE  (via drill 0.35)
  Top 0.203: D2.C D3.C 28.73,13.2 27.43,14.51 26.99,14.51 R11.2 25.15,17.1 25.1,17.15 24.7,17.15 24.4,17.45 v24.3,17.45 | v14.7,29 14.4,29.3 13.8,29.3 13.8,28.65 REG1.3
  Bottom 0.203: v14.7,29 14.7,26.8 14.45,26.55 14.45,18.5 15.5,17.45 v24.3,17.45
GND  (via drill 0.35)  (63 unrouted)
  Top 0.203: RESET.P$4 38.5,37.7 38.9,38.1 41,38.1 41.4,37.7 RESET.P$2 | AC1.1 55.55,23 55.55,22.05 56.45,21.15 56.45,19.9 56,19.45 54.5,19.45 53.75,18.7 53.75,16.2 52.95,15.4 51.65,15.4 51.15,14.9 48.05,14.9 v46.65,13.5 | v45.6,12.45 45.9,12.15 46.95,12.15 47.1,12.3 49.65,12.3 49.7,12.25 R9.1 | 69.3,17.45 67.9,17.45 67.5,17.85 67.5,18.5 IC1.4 | 69.3,17.45 69.75,17.45 | v69.15,17.3 69.3,17.45 | v67.2,15.35 67.2,13.75 65.35,11.9 63.4,11.9 61.05,9.55 61.05,6.65 58.15,3.75 55.15,3.75 v54.3,2.9 | v52.35,4.85 52.05,4.55 47.6,4.55 v47.3,4.85 | v45.35,2.9 44.5,3.75 42.75,3.75 42.5,4 37,4 36.75,3.75 26.45,3.75 26.4,3.8 26.4,6.6 28,8.2 28.15,8.2 28.55,8.6 v29,8.6 | IC1.5 67.5,20.9 67.5,21.9 67.55,21.95 v67.55,22.8 67.55,22.95 | C13.2 35.2,11.55 35.6,11.55 35.6,11.95 37.15,13.5 37.15,13.85 v37.1,13.85 | 24.25,22.1 24.75,22.1 25.05,21.8 25.05,21.6 | 24.25,22.1 24.25,22.6 23.25,22.6 23.25,21.6 24.3,21.6 24.3,22.05 24.75,22.05 v24.85,22.15 | v19.9,21.35 19.9,21.25 19.75,21.1 R15.2 | R21.1 24.25,22.1 | 33.5,25.45 33.45,25.5 33.5,25.6 | v35.35,19.85 34.85,19.85 34.05,19.05 34.05,18.5 34,18.45 33.1,18.45 C7.1 | 19.55,27.47 19.55,28.03 19.38,28.2 18.84,28.2 | U3.3 18.93,27.3 19.38,27.3 19.55,27.47 | 18.84,28.2 18.4,28.2 18.39,28.2 18.15,28.2 18.1,28.25 17.9,28.25 17.75,28.4 15.45,28.4 13.65,26.6 13.4,26.6 13.4,25.45 12.2,25.45 12.2,26.9 v12,27.1 | 18.84,28.2 U3.1 | 33.15,32.8 35.35,32.8 v35.5,32.95 | v36.9,34.35 36.9,35.4 C2.2 | v42.25,26.55 40.45,24.75 IC3.47 | 20.66,16.11 20.65,16.05 U5.4 20.55,16.15 | U3.HEAT 19.58,27.5 19.55,27.47
  Top 0.406: REG1.2 12.85,28.6 12.85,26 C10.2
  Bottom 0.203: v45.6,12.45 v46.65,13.5 | v67.2,15.35 v69.15,17.3 | v52.35,4.85 v54.3,2.9 | v45.35,2.9 v47.3,4.85 | v27.95,9.65 v29,8.6 | v24.85,22.15 20.7,22.15 v19.9,21.35 | v34.1,24.05 34.8,23.35 34.8,21.45 35.35,20.9 v35.35,19.85 | v36.9,34.35 v35.5,32.95 | v45.7,26.9 45.35,26.55 v42.25,26.55
  pour Top: 0.1,41.5 78.3,41.5 78.3,-0.2 0.1,-0.2
  pour Bottom: 0.1,41.5 78.3,41.5 78.3,-0.2 0.1,-0.2
LIPO_BAT  (via drill 0.35)
  Top 0.203: IC3.1 37.55,22.45 37.15,22.85 26,22.85 25.15,23.7 R20.2 23.1,23.7 23.1,26.35 22.7,26.75 | U3.8 21.71,28.26 21.85,28.4 | C9.1 8.26,3.2 D8.A
  Top 0.305: U3.5 22.23,26.75 | 22.23,26.75 22.7,26.75 | 21.85,28.4 v21.85,29.05 | v15.35,26.4 15.6,26.15 15.6,25.01 16.95,23.66 19.14,23.66 22.23,26.75
  Top 0.406: 11.1,28.25 11.1,26.2 C10.1 | 11.15,24.9 13.85,24.9 v15.35,26.4
  Top 0.508: C18.1 11.1,28.25 11.65,28.25 REG1.1 | v8.05,5.85 8.3,5.6 8.85,5.6 Q2.2 | v11.15,17.65 11.15,24.9 11.15,24.95 11.1,25 11.1,25.75 C10.1
  Top 0.813: D8.A 9.25,3.1 9.3,3.15 9.3,5.55 9.35,5.6 9.3,5.65 Q2.2 | 9.33,28.53 C18.1 9.05,28.85 9.05,30.05 8.7,30.4 8.7,31.4 F1.2
  Bottom 0.305: 19.5,30.35 19.5,30.26 19.46,30.22 19.46,29.58 19.99,29.05 v21.85,29.05
  Bottom 0.406: v15.35,26.4 15.35,26.7 19,30.35 19.5,30.35 19.65,30.5 19.65,30.75 19.7,30.8 U4.22
  Bottom 0.508: v8.05,5.85 8.05,14.55 8.95,15.45 8.95,15.7 10.9,17.65 v11.15,17.65
N$1
  Top 0.813: X7.1 17.15,4.35 17.1,4.3 12.9,4.3 12.85,4.25 12.85,3.15 12.8,3.1 D8.C
N$4
  Top 0.203: LED1.C 29.76,39.75 R2.2
N$5
  Top 0.203: C11.1 13.8,31.25 REG1.4
N$8
  Top 0.203: R3.1 67.9,9.25 67.9,6.65 67.45,6.2 67.45,5.2 X4.3
N$9
  Top 0.203: X4.2 66.2,5.2 66.2,6.2 66.15,6.25 66.15,8.85 65.8,9.2 64.95,9.2 R4.1 64.85,9.2 64.05,9.2 63.8,8.95 63.8,8.55 63.75,8.5 62.8,8.5 R5.1
N$11
  Top 0.813: F1.1 5.9,31.4 5.9,28.55 5.3,28.55 BAT.1
N$12
  Top 0.203: BOOT1.TP 49.75,9.95 49.7,9.9 R6.1
N$17
  Top 0.813: R27.2 R21.2 R20.1
N$25
  Top 0.203: D2.A 30.5,11.3 29.95,10.75 29.95,10.6 28,8.65 22.5,8.65 20.95,7.1 20.55,7.1 19.65,6.2 X7.3
N$28  (via drill 0.35)
  Top 0.203: R19.2 53.95,14.55 v54.1,14.7 | v60.8,13 61.1,13.3 61.95,13.3 65.5,16.85 66.4,16.85 66.7,16.55 71.55,16.55 71.9,16.9 73.65,16.9 73.7,16.95 73.7,17.9 Q1.1
  Bottom 0.203: v54.1,14.7 59.55,14.7 60.8,13.45 v60.8,13
N$29
  Top 0.813: SOL.1 7.03,19.83 D6.A
N$30
  Top 0.203: AC1.10 61,25.38 C4.2
N$32
  Top 0.203: U3.2 17.95,27.75 17.25,27.05 R22.2
N$33
  Top 0.203: C14.2 53.3,27.65 53.8,27.65 53.8,26.3 54.2,25.9 54.7,25.9 AC1.20
N$34
  Top 0.305: X1.2 73.1,12.05 72.7,12.05 L4.2 72.8,14 Q1.3
N$36
  Top 0.203: JP3.1 13.4,37.4 15.35,35.45 17.2,35.45 17.5,35.15 23.45,35.15 24.45,36.15 24.5,36.15 24.55,36.2 U1.D-1
N$38
  Top 0.203: JP3.2 17.65,35.6 23.3,35.6 23.95,36.25 23.9,36.3 U1.D+1
N$40
  Top 0.813: L2.P$2 24.3,13.5 21.95,15.85 21.95,17.6 21.6,17.95 20.97,17.95 | 20.97,17.95 U5.5 | D4.A 20.97,22.4 20.97,17.95
N$42  (via drill 0.35)
  Top 0.203: v4.45,14.25 4.45,11.85 4.39,11.79 | 4.39,11.79 J4.3 | L1.2 6.45,9.73 4.39,11.79
  Bottom 0.203: U4.11 9,18.8 v4.45,14.25
N$43
  Top 0.203: L1.1 R31.2
N$45  (via drill 0.35)
  Top 0.2: v8.05,15.85 R31.1
  Bottom 0.2: v8.05,15.85 8.3,15.85 11.2,18.75 U4.9
  Bottom 0.203: U4.9 11.2,20.5 12.3,20.5 U4.8
OSCIN
  Top 0.203: R1.2 29.05,32.65 26.25,29.85 25.3,29.85 Y1.2 27,30.5 30.35,27.15 30.35,26.15 C5.2 30.35,26.05 30.35,25.15 32.2,23.3 37.3,23.3 37.6,23 39.1,23 39.25,22.85 39.25,20.95 38.75,20.45 IC3.5
OSCOUT  (via drill 0.35)
  Top 0.203: R1.1 30.75,32.9 33.75,29.9 33.9,29.9 33.95,29.85 34.9,29.85 Y1.1 35,29.85 35.4,29.85 35.4,27.3 35.25,27.15 35.25,26.2 C6.2 35.25,26.1 v35.25,24.05 | v37.05,19.8 37.5,19.8 37.65,19.95 IC3.6
  Bottom 0.203: v35.25,24.05 35.25,21.6 v37.05,19.8
PA0  (via drill 0.35)
  Top 0.203: IC3.10 35.8,17.95 35.6,17.75 35.6,16.75 v35.95,16.4 | v34.25,15.05 32.4,13.2 D3.A
  Bottom 0.203: v35.95,16.4 35.6,16.4 v34.25,15.05
PA1  (via drill 0.35)
  Top 0.203: v39.35,17.55 38.85,17.55 38.75,17.45 IC3.11 | v24.45,19.5 24.45,20.5 R27.1
  Bottom 0.203: v39.35,17.55 38.45,17.55 38.4,17.6 28.05,17.6 27,18.65 25.3,18.65 v24.45,19.5
PA2  (via drill 0.35)
  Top 0.203: IC3.12 38,16.95 v36,14.95
  Bottom 0.203: v36,14.95 35.19,14.95 32.7,12.47 27.9,12.47 27.47,12.9 27.47,13.31 24.12,16.66 20.03,16.66 19.82,16.44 15.93,16.44 14.04,18.33 14.04,28.62 13.97,28.7 13.97,29.3 14.4,29.73 17.16,29.73 18.2,30.77 18.2,31.41 U4.21
PA3  (via drill 0.35)
  Top 0.203: v18.3,34.3 19.1,34.3 19.7,33.7 19.7,33.25 21.55,31.4 v22.95,31.4 | v40.1,16.35 39.95,16.2 IC3.13
  Bottom 0.203: U4.20 17.5,32.85 18.15,33.5 18.15,34.3 v18.3,34.3 | v22.95,31.4 22.95,30.25 34.1,19.1 36.7,19.1 37.75,18.05 38.75,18.05 39.05,18.35 39.65,18.35 40.1,17.9 v40.1,16.35
PA4
  Top 0.2: IC3.14 40.45,14.65 36.4,10.6 32.85,10.6 29.75,7.5 29.75,5.2 X5.3
PA5
  Top 0.2: IC3.15 40.95,14.55 36.55,10.15 33,10.15 31,8.15 31,5.2 X5.4
PA6
  Top 0.2: IC3.16 41.45,14.45 36.7,9.7 33.15,9.7 32.25,8.8 32.25,5.2 X5.5
PA7
  Top 0.2: X5.6 33.5,5.2 33.5,6.2 33.35,6.35 33.35,8.85 33.75,9.25 36.85,9.25 41.95,14.35 IC3.17
PA8
  Top 0.203: R19.1 50.45,16.25 47.75,18.95 IC3.29
PA9  (via drill 0.35)
  Top 0.203: IC3.30 46.65,19.45 v46.05,18.85 | v55.7,6.85 55.7,6.65 56.15,6.2 56.15,5.2 X3.3
  Bottom 0.203: v46.05,18.85 47.85,18.85 50.45,16.25 50.9,16.25 54.95,12.2 54.95,7.6 v55.7,6.85
PA10  (via drill 0.35)
  Top 0.203: IC3.31 47.75,19.95 48.25,19.45 48.25,19.05 50.3,17 v50.75,17 | v55.7,12.05 55.4,11.75 55.4,8.2 57.4,6.2 57.4,5.2 X3.4
  Bottom 0.203: v55.7,12.05 v50.75,17
PA11  (via drill 0.35)
  Top 0.203: IC3.32 53.1,20.45 53.4,20.2 v55.7,20.2 | v66.25,11.15 66.45,10.95 R3.2
  Bottom 0.203: v55.7,20.2 55.7,19.75 63.55,11.9 65.5,11.9 v66.25,11.15
PA12  (via drill 0.35)
  Top 0.203: IC3.33 v53.9,20.95 | v63.7,11.15 63.95,10.9 R4.2
  Bottom 0.203: v63.7,11.15 v53.9,20.95
PA15  (via drill 0.35)
  Top 0.203: U3.7 26,27.75 27,26.75 27,26 27.05,25.95 R23.1 | R23.1 | IC3.38 44.95,27.3 v45.75,28.1 | v29.1,26.64 28.49,26.64 R23.1
  Bottom 0.203: v45.75,28.1 43.29,28.1 39.7,31.68 34.15,31.68 v29.1,26.64
PB0  (via drill 0.35)
  Top 0.203: IC3.18 42.45,14.25 40.15,11.95 v40.15,11.5 | v19.35,15.65 19.35,17.55 18.95,17.95 U5.1 18.05,18.05 R15.1
  Bottom 0.203: v40.15,11.5 28.25,11.5 27,12.75 27,13.2 23.95,16.25 20.2,16.25 19.9,15.95 19.65,15.95 v19.35,15.65
PB1
  Top 0.2: IC3.19 42.95,11 R14.2
  Top 0.203: R14.2 46.15,6.3 46.05,6.2 X2.3
PB3
  Top 0.203: 63.09,35.35 R17.1 | 63.09,35.35 C15.1 65.1,36.55 | 65.1,36.55 65.1,36.9 64.3,37.7 OPTION.P$4 | 65.1,36.55 66.05,36.55 67.2,37.7 OPTION.P$2 | IC3.39 44.45,28.42 46.11,30.08 46.11,31.2 57.8,31.2 61.9,35.3 63.04,35.3 63.09,35.35
PB4
  Top 0.203: 56.8,36.55 56.8,36.8 55.9,37.7 PREV.P$4 | 56.8,36.55 C16.1 R18.1 51.1,31.75 45.7,31.75 45.7,30.25 43.95,28.5 IC3.40 | 56.8,36.55 57.65,36.55 58.8,37.7 PREV.P$2
PB5
  Top 0.203: 48.3,36.55 48.3,36.9 47.5,37.7 NEXT.P$4 | 48.3,36.55 C3.1 R16.1 45.2,35.35 45.15,35.3 45.15,34.2 | 48.3,36.55 49.25,36.55 50.4,37.7 NEXT.P$2 | IC3.41 43.45,28.7 45.15,30.4 45.15,34.2 | 45.15,34.2 44.8,34.2 44.75,34.25 D1.A
PB8  (via drill 0.35)
  Top 0.203: U3.6 23.8,27.25 25.1,25.95 R28.1 26.2,25.95 26.45,25.95 26.9,25.5 27,25.5 27.3,25.2 28.3,25.2 28.55,24.95 v29.3,24.95 | IC3.45 41.45,23.65 42.5,22.6 42.5,21.75 v42.15,21.75
  Bottom 0.203: v42.15,21.75 39.7,19.3 38.6,19.3 37.35,20.55 36.9,20.55 35.7,21.75 35.7,23.45 36,23.75 36,24.35 35.4,24.95 v29.3,24.95
PB10  (via drill 0.35)
  Top 0.203: v43.95,17.8 IC3.21
  Bottom 0.203: v43.95,17.8 47.9,21.75 52.05,21.75 52.35,21.45 53.35,21.45 54.55,22.65 66.15,22.65 66.8,22 HM13.UART_RX
PB11  (via drill 0.35)
  Top 0.203: IC3.22 44.45,14.65 46.35,12.75 53.7,12.75 v54.9,13.95 | v58.4,13.75 61.8,13.75 65.35,17.3 v67,17.3
  Bottom 0.203: v54.9,13.95 58.2,13.95 v58.4,13.75 | v67,17.3 67.1,17.3 69.8,20 HM13.UART_TX
PB12  (via drill 0.35)
  Top 0.2: X5.7 34.75,5.2 34.75,6.2 34.8,6.25 34.8,6.6 37.7,9.5 40.7,9.5 42.5,11.3 42.5,12.3 v42.2,12.6 | v46.1,16.5 46.55,16.95 IC3.25
  Bottom 0.2: v46.1,16.5 v42.2,12.6
PB13  (via drill 0.35)
  Top 0.203: v42.55,10.3 42.1,10.3 40.85,9.05 37.85,9.05 36,7.2 36,5.2 X5.8 | v47.45,15.75 48.15,16.45 48.15,17.05 47.75,17.45 IC3.26
  Bottom 0.203: v42.55,10.3 42.55,11.9 42.95,12.3 42.95,12.75 45.95,15.75 v47.45,15.75
PC13  (via drill 0.35)
  Top 0.203: IC3.2 37.35,21.95 37.3,21.9 34.25,21.9 v34.05,22.1 | v32.5,24.2 31.2,25.5 31.2,26.8 30.8,27.2 30.8,27.3 29.95,28.15 29.95,33.05 29.9,33.1 29.9,34.45 29.95,34.5 29.95,37.3 R2.1
  Bottom 0.203: v34.05,22.1 34.05,22.65 v32.5,24.2
PC14
  Top 0.203: Y2.4 31.1,21.8 32.05,21.8 32.1,21.75 32.1,20.3 32.2,20.2 33.05,20.2 C7.2 33.15,20.2 34.05,20.2 34.4,20.55 34.4,21.45 IC3.3
PC15
  Top 0.203: IC3.4 35.38,20.95 33.79,19.37 30.3,19.37 Y2.1 27.8,21.8 27,21.8 26.65,21.45 26.65,19.9 26.6,19.85 25.65,19.85 C8.2
RESET  (via drill 0.35)
  Top 0.203: RESET.P$1 41.4,39.5 40.95,39.05 38.95,39.05 38.5,39.5 RESET.P$3 35.95,39.5 35.7,39.25 R10.1 | IC3.7 38.75,19.45 39.35,20.05 v39.4,20.05 | v39.4,30.95 39.25,30.95 35.2,35 35.2,35.5 C2.1
  Top 0.254: C2.1 35.6,39.2 R10.1
  Bottom 0.203: v39.4,30.95 v39.4,20.05
SCL1  (via drill 0.35)
  Top 0.203: v61.2,16.75 60.9,17.05 59.7,17.05 59.05,16.4 59.05,15.4 U2.6 | v62.8,18.35 62.8,19.35 63.3,19.85 63.7,19.85 63.75,19.9 63.75,20.8 IC1.8 63.75,21 63.75,21.9 v62.25,23.4 64.87,26.02 65.12,26.02 65.46,26.36 65.46,27.55 65.89,27.98 66.37,27.98 67.34,27 IC2.8 | IC3.42 42.95,23.65 43.65,22.95 46.25,22.95 47.35,24.05 53.55,24.05 | 53.55,24.05 53.9,24.05 54.2,24.35 54.7,24.35 AC1.23 | v53.55,24.15 53.55,24.05 | 67.4,27 IC2.8 | R13.1 67.4,27.55 67.4,27.1 IC2.8
  Bottom 0.203: v62.8,18.35 v61.2,16.75 | v53.55,24.15 54.6,23.1 61.95,23.1 v62.25,23.4
SDA1  (via drill 0.35)
  Top 0.203: U2.5 61.9,15.4 v62.9,16.4 | v72.61,19.16 72.24,19.52 72.23,19.52 66.45,25.3 | IC2.7 66.37,26.76 66.37,25.38 66.45,25.3 | IC1.7 64.98,23.09 64.98,23.1 64.98,23.84 65.8,24.66 | 65.8,24.66 66.45,25.3 | R12.1 55.15,29.4 v54.8,29.05 | IC3.43 42.44,23.66 42.44,23.58 43.8,22.23 v43.8,22.15 | AC1.24 54.27,23.83 53.85,23.42 52.77,23.42 v52.6,23.25 | v65.5,25.13 65.5,24.97 65.8,24.66
  Bottom 0.203: v62.9,16.4 67.21,16.4 68.85,18.03 71.48,18.03 v72.61,19.16 | 49.61,27.96 50.7,29.05 v54.8,29.05 60.66,29.05 63.42,26.29 64.34,26.29 v65.5,25.13 | 49.61,27.96 v43.8,22.15 | v52.6,23.25 52.6,24.96 49.61,27.96
TPB0
  Top 0.203: BOOT0.TP 39,33.5 39.05,33.55 39.05,33.95 39.15,34.05 R7.2 40.1,34.05 40.45,34.05 40.65,34.25 D1.C
USB5V  (via drill 0.35)
  Top 0.508: U1.VBUS1 25.25,37.26 25.25,36 v25.3,36
  Top 0.813: v0.8,7.45 7.93,7.45 8.71,7.43 8.97,7.48 Q2.1 10.26,7.39 10.49,7.62 13.17,7.62 D5.A 17.82,9.55 D7.A 19.94,9.48 R24.2
  Bottom 0.813: v25.3,36 26.25,36.67 26.89,37.31 26.89,38.21 24.95,40.15 7.9,40.15 5.03,36.87 4.56,36.56 4.43,36.46 4.01,36.29 3.5,36.08 1.88,35.88 0.75,35.05 0.7,7.35 v0.8,7.45 0.8,7.5
VCC3V3  (via drill 0.35)
  Top 0.203: TPVCC.TP 38.3,27.95 38.65,28.3 38.65,29.6 38.7,29.6 C1.1 | v62.85,30.35 63.6,30.35 63.65,30.3 63.65,29.45 IC2.4 | AC1.13 58.1,29.25 R12.2 | AC1.8 59.9,24.34 59.9,23.9 | LED1.A | LED1.A 33.65,40.56
  Top 0.254: R10.2 34.7,38.4 34.7,36.3 34.72,36.28 34.72,34.86 38.62,30.96 C1.1 39.95,28.48 IC3.48 39.95,22.15 42.15,19.95 42.55,20.35 | 42.55,20.35 43.2,20.35 45.3,22.45 IC3.36 | 42.55,20.35 40.65,18.45 IC3.9 35.65,18.45 35.15,17.95 35.15,13.34 C13.1 34.91,13.31 28.5,6.9 28.5,5.23 X5.2 | 56.5,15.5 U2.8 | 56.5,17.8 C23.1 | IC2.4 64.27,28.75 64.62,28.39 65.13,28.39 65.48,28.75 IC2.2 IC2.1 | IC2.1 69.45,29.4 R13.2 | IC2.1 67.38,30.9 C20.1
  Top 0.305: R14.1 44.45,6.55 44.8,6.2 X2.2 44.8,4.1 45.2,3.7 46.9,3.7 47,3.8 47,4 47.05,4.05 52.6,4.05 52.75,3.9 52.75,3.75 52.8,3.7 54.45,3.7 54.9,4.15 54.9,5.2 X3.2 54.9,5.35 54.9,12.8 56.5,14.4 56.5,15.25 U2.8 56.5,15.6 56.5,17.7 C23.1 56.65,17.55 59.9,17.55 | 63.75,17.6 63.75,18.5 IC1.1 | 63.75,17.6 63.7,17.55 59.9,17.55 | 59.9,23.9 59.9,17.55 | 59.9,23.9 59.9,23.95 | 59.9,23.9 61.55,23.9 63.65,26 63.65,27 IC2.5 63.62,29.42 63.65,29.45 | 63.75,17.6 63.9,17.55 64.95,17.55 65,17.6 65,18.5 IC1.2 65,18.65 65,19.5 65.15,19.65 68.2,19.65 68.25,19.6 68.25,19.1 68.6,18.75 69.5,18.75 C21.1 69.65,18.75 70.5,18.75 70.55,18.8 71.85,18.8 71.9,18.75 71.9,17.95 Q1.2
  Top 0.508: C12.1 11.65,34.1 11.65,33.15 11.9,32.9 11.9,31.25 REG1.5 11.9,31 11.9,30.25 12.25,29.9 v20.25,29.9 | 31.3,40.55 LED1.A | R10.2 33.65,40.56 v33.65,40.65 | v44.85,39.55 45.45,39.55 45.5,39.5 NEXT.P$3 48.17,39.5 48.57,39.09 49.33,39.09 49.73,39.5 NEXT.P$1 PREV.P$3 56.57,39.5 56.97,39.09 57.73,39.09 58.13,39.5 PREV.P$1 61.4,39.5 | 61.4,39.5 OPTION.P$3 64.97,39.5 65.37,39.09 66.13,39.09 66.53,39.5 OPTION.P$1 | v61.3,36.7 61.35,36.7 61.4,36.75 61.4,39.5 | R12.2 58.25,29.6 v60.75,32.1
  Bottom 0.203: v62.85,30.35 62.67,30.17
  Bottom 0.508: v20.25,29.9 20.75,30.4 20.75,30.75 20.8,30.8 U4.23 20.8,33.15 22.75,35.1 25.95,35.1 30.35,39.5 31.7,39.5 31.75,39.45 R10.2 v33.65,40.65 33.75,40.9 33.8,40.95 43.35,40.95 44.75,39.55 v44.85,39.55 | v61.3,36.7 61.3,36.3 60.85,35.85 60.85,35.55 60.8,35.5 HM13.VCC 60.75,34.45 v60.75,32.1 62.67,30.17 63.55,29.3 63.55,26.95 63.65,26.85
VDD5V  (via drill 0.35)
  Top 0.203: X4.1 64.95,5.6 64.95,6.1 64.3,6.75 63.8,6.75 63.75,6.8 62.8,6.8 R5.2
  Top 0.813: U5.2 17.25,17 17.15,16.9 16.95,16.9 16.92,16.88 | 16.92,16.88 16.65,16.6 16.65,13.8 16.9,13.55 17.9,13.55 D7.C 18.3,13.55 18.9,13.55 18.95,13.5 18.95,12.55 v19.45,12.05 | 16.92,16.88 16.65,17.15 16.65,21.95 16.2,22.4 D4.C 14.3,22.4 14.25,22.35 12.75,22.35 C26.A | v64.95,3.55 64.95,5.2 X4.1
  Bottom 0.813: v64.95,3.55 62.1,0.7 30.8,0.7 v19.45,12.05
VIN  (via drill 0.35)
  Top 0.203: U3.4 19.1,26.75 19.15,26.7 v19.15,25.95 | v25,24.55 25.1,24.45 R28.2
  Top 0.406: 15.1,15.9 15.65,15.9 15.8,16.05 15.8,21.15 v15.6,21.35 | v18.7,24.45 18.7,25.5 v19.15,25.95
  Top 0.508: D6.C 15.1,15.9 D5.C 14.85,13.15 12.05,13.15 11.9,13 C17.+
  Top 0.61: R28.2 26.2,24.45 R23.2
  Bottom 0.203: v19.15,25.95 23.6,25.95 v25,24.55
  Bottom 0.406: v18.7,24.45 v15.6,21.35

### Text on the board
tPlace: FreeVario / F103 | + | B0 | + | B1 | Piezo | Serial 1 | EN | SPI | HM | USB | +
bPlace: FreeVario F103 V1.1 / http://freevario.org